# EasyEDA Pro project ProPrj_多功能方向盘_2025-05-18.epro, board PCB1
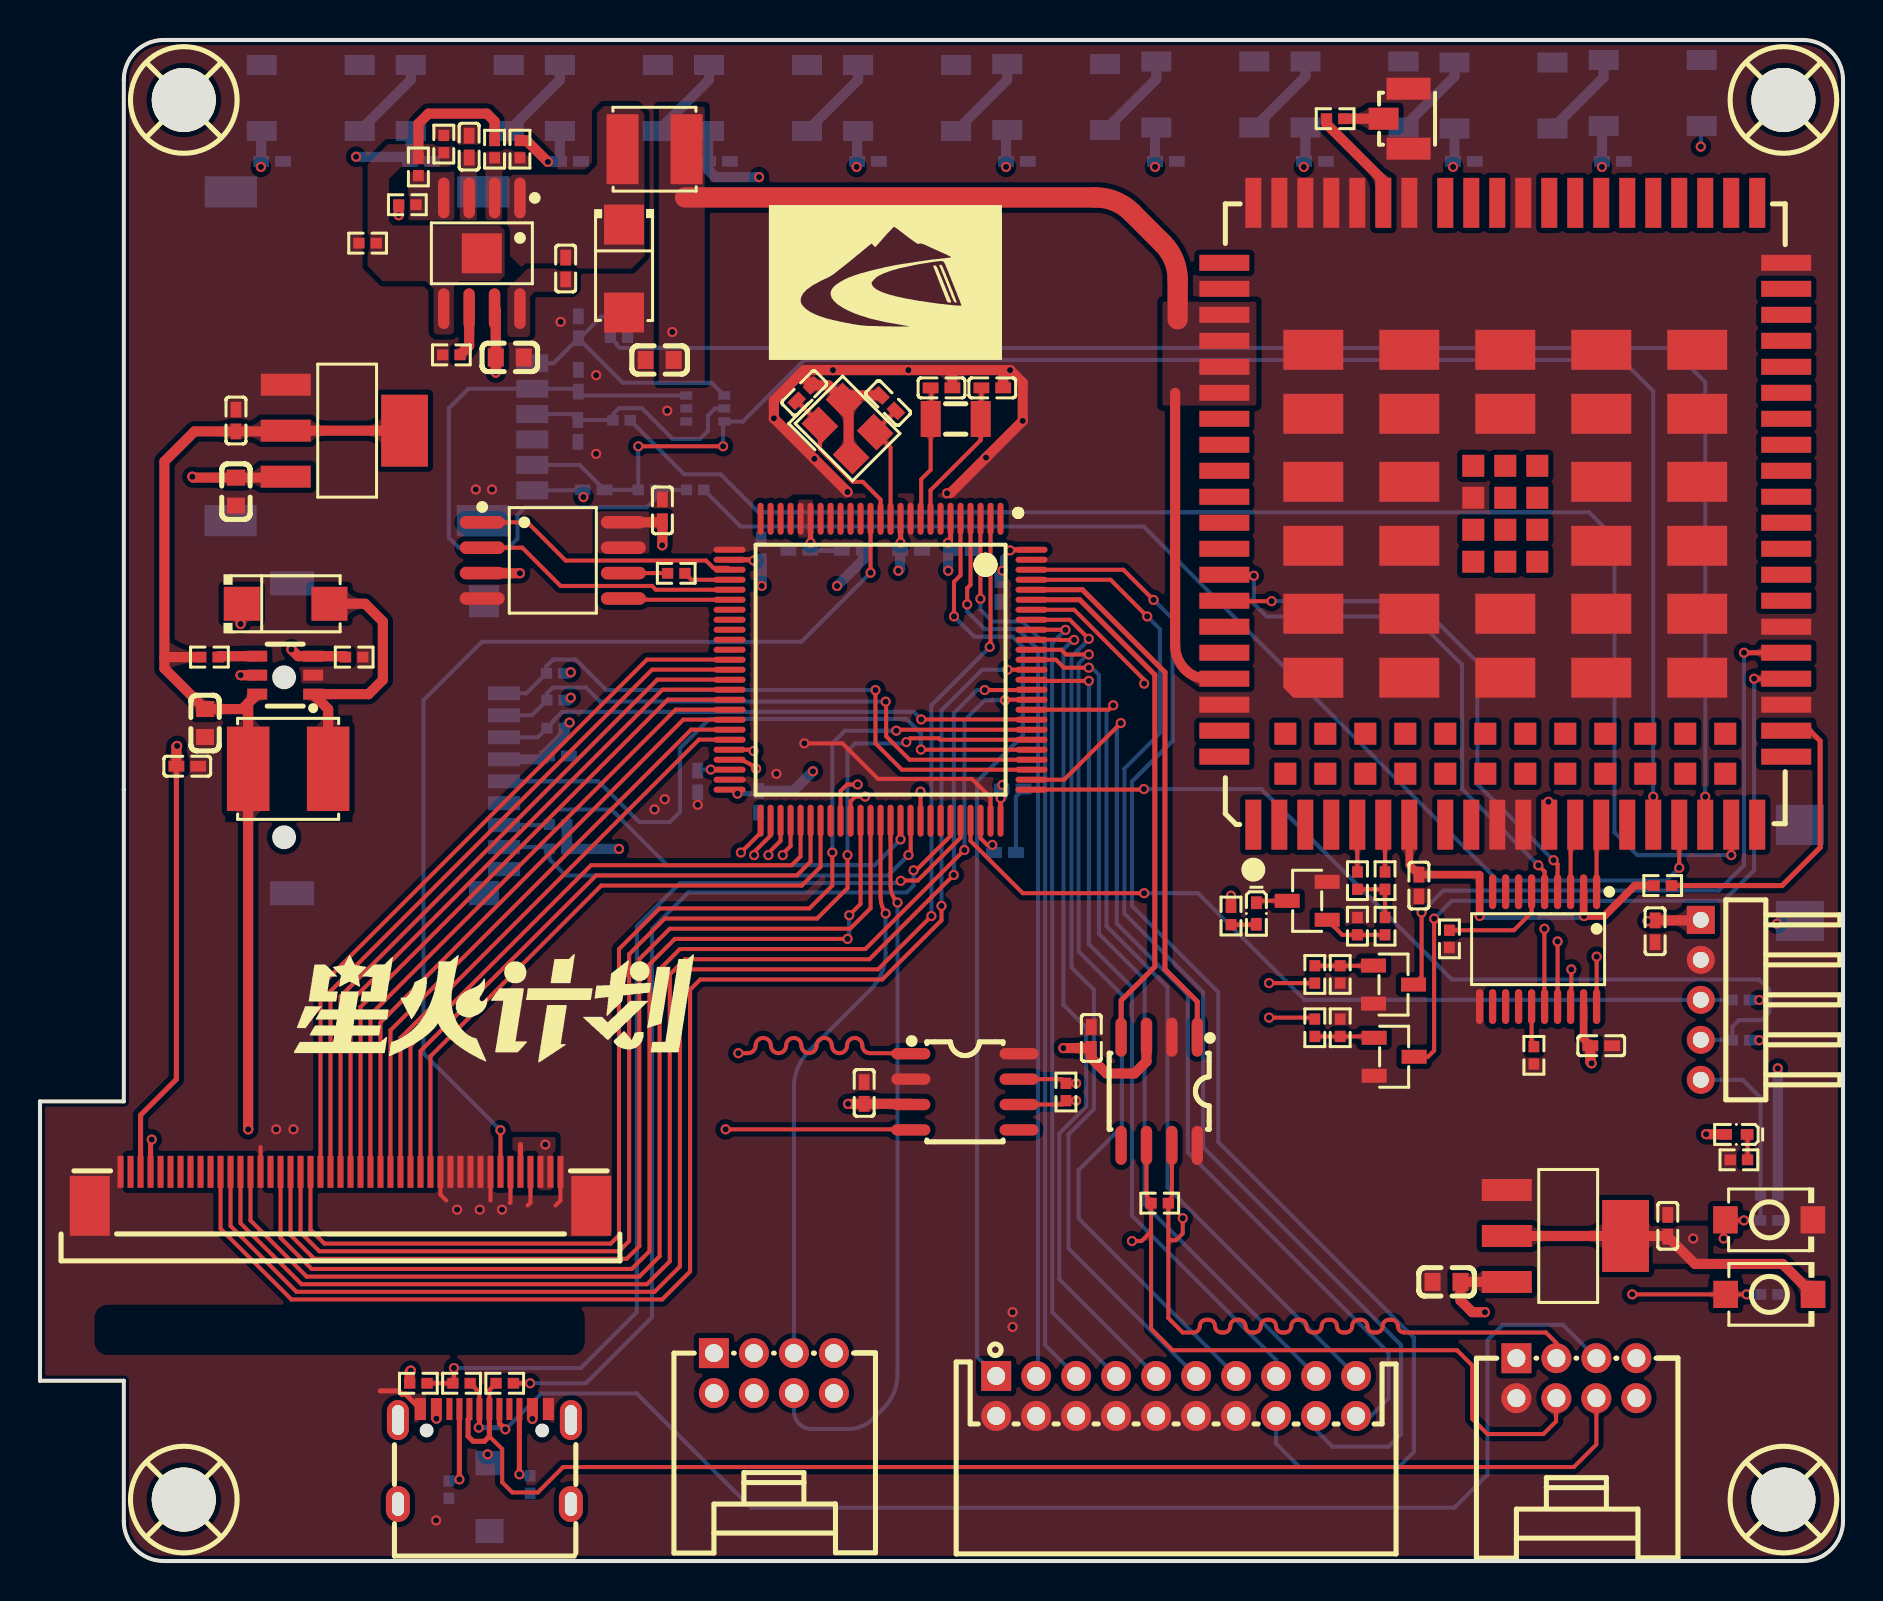
[diagram p1: board, top side]
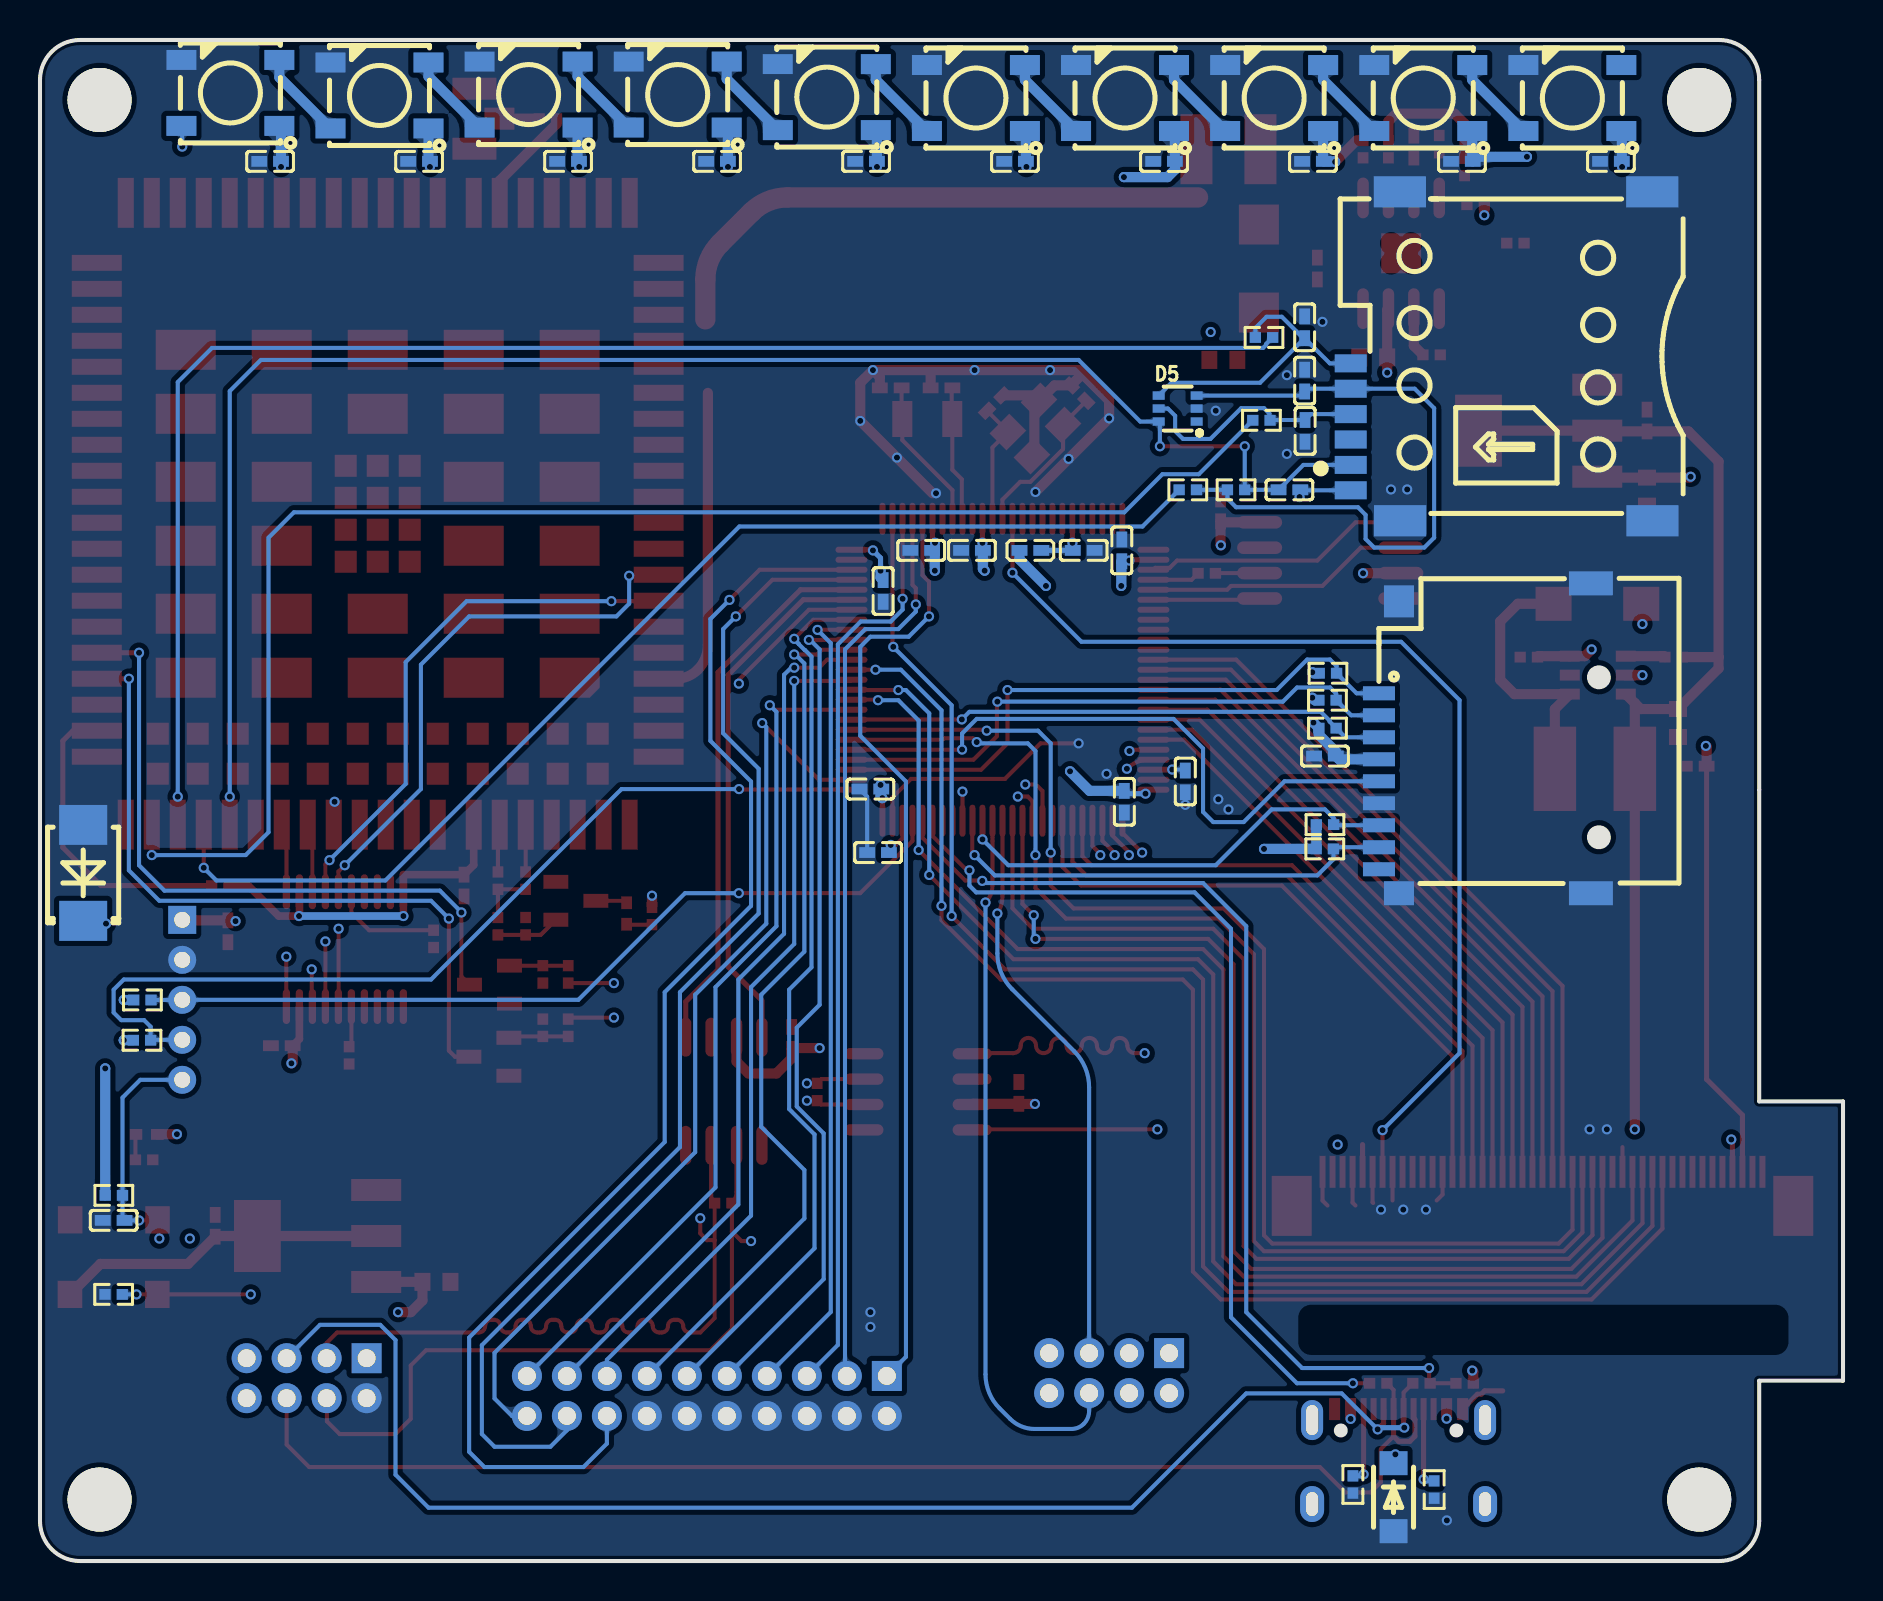
[diagram p2: board, bottom side, seen from below]

Outline 90.17 x 76.07 mm; copper layers: Top Layer, Inner1, Inner2, Bottom Layer. Coordinates in mm from the lower left corner of the outline.
Outline path: 0,22.99 0,9.02 4.19,9.02 4.19,2 arc(4.78,0.59) 6.19,0 88.17,0 arc(89.58,0.59) 90.17,2 90.17,74.07 arc(89.58,75.49) 88.17,76.07 6.19,76.07 arc(4.78,75.49) 4.19,74.07 4.19,22.99 0,22.99
Stack: Top Layer 0.035mm 外层铜厚1oz / Dielectric1 0.2104mm 7628 RC49% 8.6mil / Inner1 0.0152mm 内层铜厚 / Dielectric2 1.065mm 1.1mm H/HOZ Copper / Inner2 0.0152mm 内层铜厚 / Dielectric3 0.2104mm 7628 RC49% 8.6mil / Bottom Layer 0.035mm 外层铜厚1oz

## Design rules (mm)
template: 自定义配置
spacing copperThickness1oz (default): track to track 0.152, other pairs 0.152 to 0.3
spacing copperThickness2oz: track to track 0.203, other pairs 0.152 to 0.3
track width copperThickness1oz (default): min 0.127, default 0.254, max 2.54
track width copperThickness2oz: min 0.203, default 0.254, max 2.54
differential pair differentialPair (default): width min 0.127, default 0.254, max 2.54; gap min 0.152, default 0.152
via viaSize (default): diameter min 0.5, default 0.61, max 10; hole min 0.3, default 0.305, max 6.3
pour e581 uses copperRegion1
pour e645 uses copperRegion1
pour e661 uses copperRegion1
pour e714 uses copperRegion1
pour e723 uses copperRegion1
pour e736 uses copperRegion1
pour e789 uses copperRegion1
pour e815 uses copperRegion1
pour e1085 uses copperRegion1
pour e1437 uses copperRegion1
pour e1636 uses copperRegion1
pour e1892 uses copperRegion1
pour e3133 uses copperRegion1
pour e3984 uses copperRegion1
pour e4496 uses copperRegion1
pour e4618 uses copperRegion1
pour e5015 uses copperRegion1

## Placement (name value [footprint] x y rotation side)
C1  100nF  [C0402]  31.13 52.55 270 top
C2  100nF  [C0402]  68.96 33.78 90 top
C3  100nF  [C0402]  78.08 25.77 0 top
C4  100nF  [C0402]  52.58 26.16 270 top
C5  100nF  [C0402]  41.22 23.41 270 top
C6  100nF  [C0402]  80.77 31.5 90 top
C7  100nF  [C0402]  26.29 64.64 270 top
C8  22uF  [C0603]  30.99 60.07 180 top
C9  10uF  [C0603]  23.5 60.2 0 top
C10  2.2uF  [C0402]  32.89 38.99 90 bottom
C11  2.2uF  [C0402]  48.26 35.43 180 bottom
C12  12pF  [C0402]  45.09 58.67 180 top
C13  12pF  [C0402]  47.62 58.67 180 top
C14  220pF  [C0402]  21.46 70.74 270 top
C15  100nF  [C0402]  43.56 50.55 180 bottom
C16  100nF  [C0402]  46.1 50.55 180 bottom
C17  100nF  [C0402]  48.01 48.51 90 bottom
C18  100nF  [C0402]  48.64 38.61 180 bottom
C19  100nF  [C0402]  35.94 37.97 90 bottom
C20  100nF  [C0402]  36.07 50.55 270 bottom
C21  9pF  [C0402]  38.23 58.41 225 top
C22  9pF  [C0402]  42.42 57.91 315 top
C23  10uF  [C0603]  70.34 13.96 0 top
C24  100nF  [C0402]  81.41 16.76 90 top
C25  100nF  [C0402]  37.97 50.55 0 bottom
C26  10uF  [C0603]  8.25 41.91 270 top
C27  1uF  [C0402]  7.37 39.75 0 top
C28  10uF  [C0603]  9.8 53.49 90 top
C29  100nF  [C0402]  9.8 57.04 90 top
C30  100nF  [C0402]  86.49 17.04 0 bottom
C31  100nF  [C0402]  25.91 40.26 0 bottom
C32  100nF  [C0402]  27.69 53.58 0 bottom
C33  30pF  [C0402]  26.92 61.7 270 bottom
C34  30pF  [C0402]  26.92 59.04 270 bottom
C35  30pF  [C0402]  26.9 56.52 90 bottom
C36  100nF  [C0402]  19.06 70 0 bottom
C37  100nF  [C0402]  11.61 70 0 bottom
C38  100nF  [C0402]  41.41 70 0 bottom
C41  100nF  [C0402]  33.96 70 180 bottom
C42  100nF  [C0402]  63.76 70 180 bottom
C43  100nF  [C0402]  26.51 70 180 bottom
C44  100nF  [C0402]  48.86 70 0 bottom
C45  100nF  [C0402]  56.31 70 180 bottom
C46  100nF  [C0402]  71.21 70 0 bottom
C47  100nF  [C0402]  78.66 70 180 bottom
CAN1  TJA1050T/CM,118  [SOIC-8_L5.0-W4.0-P1.27-LS6.0-BL]  55.97 23.49 180 top
CAN2  TJA1050T/CM,118  [SOIC-8_L5.0-W4.0-P1.27-LS6.0-BL]  46.26 23.47 270 top
CARD1  TF PUSH  [TF-SMD_TF-PUSH]  17.91 41.15 90 bottom
CN1  HC-PHD-2*10AW  [CONN-TH_20P-P2.00_HCTL_HC-PHD]  56.82 8.25 0 top
CN2  HC-PHB-2*4AW  [CONN-TH_8P-P2.00_HCTL_HC-PHB-2X4AW]  76.84 9.14 0 top
CN3  HC-PHB-2*4AW  [CONN-TH_8P-P2.00_HCTL_HC-PHB-2X4AW]  36.7 9.4 0 top
D1  B340A  [SMA_L4.3-W2.6-LS5.1-RD]  29.21 64.64 270 top
D2  SMBJ3.3A  [SMB_L4.4-W3.6-LS5.3-R-RD]  88.01 34.42 90 bottom
D3  SMF5.0A  [SOD-123FL_L2.8-W1.9-LS3.7-RD]  22.48 3.19 270 bottom
D4  1N5819  [SMA_L4.4-W2.6-LS5.0-RD]  12.28 47.88 0 top
D5  SMF05C.TCT  [SC-70-6_L2.2-W1.3-P0.65-LS2.1-BR]  33.27 57.64 180 bottom
DISPLAY1  AFC07-S45FCC-00  [FPC-SMD_45P-P0.50_SLIDE-LOCK-BOTTOM-CONTACT]  15.03 18.61 0 top
FLASH1  W25Q128JVSIQ  [SOIC-8_L5.3-W5.3-P1.27-LS8.0-BL]  25.65 50.05 270 top
H1  五线下载电路  [HDR-TH_5P-P2.00-H-M_2005WR-5P]  83.06 28.07 270 top
JP1  U.FL-R-SMT-1(10)  [ANT-SMD_UFL-R-SMT-1-10]  67.82 72.14 0 top
L1  10uH  [IND-SMD_L4.0-W4.0]  30.73 70.61 180 top
L2  BLM15PD121SN1D  [L0402]  40.64 50.55 180 bottom
L3  22uH  [IND-SMD_L5.0-W5.0_H4.0]  12.41 39.62 0 top
LED1  NCD0402R1  [LED0402-RD]  84.84 21.34 180 top
LED2  NCD0402R1  [LED0402-RD]  60.83 32.39 270 top
LED3  WS2812B-B  [LED-SMD_4P-L5.0-W5.0-TL_WS2812B-B]  80.65 73.42 0 bottom
LED4  WS2812B-B  [LED-SMD_4P-L5.0-W5.0-TL_WS2812B-B]  73.19 73.3 0 bottom
LED5  WS2812B-B  [LED-SMD_4P-L5.0-W5.0-TL_WS2812B-B]  65.73 73.34 0 bottom
LED6  WS2812B-B  [LED-SMD_4P-L5.0-W5.0-TL_WS2812B-B]  58.28 73.34 0 bottom
LED7  WS2812B-B  [LED-SMD_4P-L5.0-W5.0-TL_WS2812B-B]  50.82 73.22 0 bottom
LED8  WS2812B-B  [LED-SMD_4P-L5.0-W5.0-TL_WS2812B-B]  13.53 73.17 0 bottom
LED9  WS2812B-B  [LED-SMD_4P-L5.0-W5.0-TL_WS2812B-B]  20.99 73.17 0 bottom
LED10  WS2812B-B  [LED-SMD_4P-L5.0-W5.0-TL_WS2812B-B]  28.45 73.17 0 bottom
LED11  WS2812B-B  [LED-SMD_4P-L5.0-W5.0-TL_WS2812B-B]  35.91 73.17 0 bottom
LED12  WS2812B-B  [LED-SMD_4P-L5.0-W5.0-TL_WS2812B-B]  43.36 73.17 0 bottom
Q1  S8050  [SOT-23-3_L2.9-W1.3-P1.90-LS2.4-BR]  67.72 25.22 180 top
Q2  S8050  [SOT-23-3_L2.9-W1.3-P1.90-LS2.4-BR]  67.69 28.83 180 top
Q3  S8050  [SOT-23-3_L2.9-W1.3-P1.90-LS2.4-BR]  63.37 33.02 0 top
R1  0Ω  [R0402]  65.89 34.03 90 top
R2  0Ω  [R0402]  67.27 34.03 90 top
R3  22Ω  [R0402]  31.82 49.4 0 top
R4  51kΩ  [R0402]  70.49 31.12 90 top
R5  51kΩ  [R0402]  74.71 25.29 270 top
R6  120Ω  [R0402]  56 17.9 0 top
R7  5.6kΩ  [R0402]  63.75 26.67 270 top
R8  5.6kΩ  [R0402]  63.75 29.34 90 top
R9  51kΩ  [R0402]  65.02 26.67 90 top
R10  51kΩ  [R0402]  65.02 29.34 270 top
R11  1kΩ  [R0402]  81.15 33.78 180 top
R12  0Ω  [R0402]  64.77 72.14 0 top
R13  120Ω  [R0402]  51.31 23.46 90 top
R14  24.9kΩ  [R0402]  22.73 70.61 270 top
R15  100kΩ  [R0402]  24 70.61 270 top
R16  10kΩ  [R0402]  85.05 28.06 0 bottom
R17  10kΩ  [R0402]  85.07 26.05 0 bottom
R18  4.7kΩ  [R0402]  84.96 20.07 180 top
R19  124kΩ  [R0402]  18.37 67.83 0 top
R20  200kΩ  [R0402]  20.57 60.33 180 top
R21  40.2kΩ  [R0402]  18.92 69.72 270 top
R22  0Ω  [R0402]  16.38 65.91 180 top
R23  68.1kΩ  [R0402]  20.19 70.87 90 top
R24  5.1kΩ  [R0402]  20.45 3.57 270 bottom
R25  1kΩ  [R0402]  59.56 32.26 90 top
R26  5.1kΩ  [R0402]  24.51 3.83 270 bottom
R27  10kΩ  [R0402]  86.49 13.34 180 bottom
R28  5.6kΩ  [R0402]  67.27 31.75 270 top
R29  51kΩ  [R0402]  65.89 31.75 90 top
R30  22Ω  [R0402]  23.24 8.89 180 top
R31  10kΩ  [R0402]  86.48 18.29 180 bottom
R32  22Ω  [R0402]  21.08 8.89 0 top
R33  1.5kΩ  [R0402]  18.92 8.89 0 top
R34  10kΩ  [R0402]  8.47 45.21 0 top
R35  7.5Ω  [R0402]  15.71 45.21 180 top
R36  10kΩ  [R0402]  25.91 36.83 180 bottom
R37  10kΩ  [R0402]  25.92 35.62 180 bottom
R38  10kΩ  [R0402]  25.76 44.4 180 bottom
R39  10kΩ  [R0402]  25.78 43.05 180 bottom
R40  10kΩ  [R0402]  25.78 41.66 180 bottom
R41  10kΩ  [R0402]  30.35 53.58 180 bottom
R42  22Ω  [R0402]  29.09 57.05 0 bottom
R43  22Ω  [R0402]  32.77 53.58 0 bottom
R44  22Ω  [R0402]  28.96 61.2 180 bottom
SCREW1  -  [M3螺丝]  7.19 73.07 0 top
SCREW2  -  [M3螺丝]  87.19 73.07 0 top
SCREW3  -  [M3螺丝]  7.19 3.07 0 top
SCREW4  -  [M3螺丝]  87.19 3.07 0 top
SIM1  SMC-202-6  [SIM-SMD_SMC-202-6]  17.08 60.25 90 bottom
SW1  TS-1088R-02026  [SW-SMD_L3.9-W3.0-P4.45]  86.49 13.34 0 top
SW2  TS-1088R-02026  [SW-SMD_L3.9-W3.0-P4.45]  86.48 17.06 0 top
U1  STM32H743VIT6  [LQFP-100_L14.0-W14.0-P0.50-LS16.0-BL]  42.04 44.58 180 top
U2  EC200UCNLA-N05-SGNSA  [LCC-LGA-144_L31.0-W28.0-P1.30_L610-CN-02]  73.28 52.38 90 top
U3  TXS0108EPWR  [TSSOP-20_L6.5-W4.4-P0.65-LS6.4-BL]  74.92 30.6 180 top
U4  MP1584EN-LF-Z  [SOIC-8_L5.0-W4.0-P1.27-LS6.0-BL-EP2.0]  22.1 65.41 180 top
U5  WD1117-3.3(1.35A)  [SOT-223-3_L6.5-W3.4-P2.30-LS7.0-BR]  76.33 16.26 180 top
U7  RT9293BGJ6  [SOT-23-6_L2.9-W1.6-P0.95-LS2.8-BR]  12.26 44.31 0 top
U8  WD1117-3.3(1.35A)  [SOT-223-3_L6.5-W3.4-P2.30-LS7.0-BR]  15.26 56.53 180 top
USB1  TYPE-C 16PIN  [USB-C-SMD_TYPE-C-6PIN-2MD-073]  22.22 5.22 0 top
X1  32.768kHz  [FC-135R_L3.2-W1.5]  45.79 57.12 0 top
X2  25MHz  [CRYSTAL-SMD_4P-L3.2-W2.5-BL]  40.39 56.64 315 top

## Footprints (pads in the part's own frame, mm; a bottom-side part is the same pattern mirrored in y, then rotated)
ANT-SMD_UFL-R-SMT-1-10
  rect 2.2x1.1 smd: 1(0.625,1.5) 3(0.625,-1.5)
  rect 1.5x1.1 smd: 2(-0.625,0.001)
C0402
  rect 0.79x0.54 smd: 1(-0.545,0) 2(0.545,0)
C0603
  rect 0.8x0.9 smd: 1(-0.7,0) 2(0.7,0)
CONN-TH_8P-P2.00_HCTL_HC-PHB-2X4AW
  rect 1.5x1.5 hole 0.9: 1(-3,1)
  round 1.5 hole 0.9: 2(-3,-1) 3(-1,1) 4(-1,-1) 5(1,1) 6(1,-1) 7(3,1) 8(3,-1)
CONN-TH_20P-P2.00_HCTL_HC-PHD
  rect 1.5x1.5 hole 0.9: 1(-9,1)
  round 1.5 hole 0.9: 2(-9,-1) 3(-7,1) 4(-7,-1) 5(-5,1) 6(-5,-1) 7(-3,1) 8(-3,-1) 9(-1,1) 10(-1,-1) 11(1,1) 12(1,-1) 13(3,1) 14(3,-1) 15(5,1) 16(5,-1) 17(7,1) 18(7,-1) 19(9,1) 20(9,-1)
CRYSTAL-SMD_4P-L3.2-W2.5-BL
  rect 1.4x1.2 smd: 1(-1.1,-0.85) 2(1.1,-0.85) 3(1.1,0.85) 4(-1.1,0.85)
FC-135R_L3.2-W1.5
  rect 1x1.8 smd: 1(-1.25,0) 2(1.25,0)
FPC-SMD_45P-P0.50_SLIDE-LOCK-BOTTOM-CONTACT
  rect 0.299x1.6 smd: 1(11.001,0.851) 2(10.501,0.851) 3(10,0.851) 4(9.499,0.851) 5(8.999,0.851) 6(8.499,0.851) 7(8.001,0.851) 8(7.5,0.851) 9(7,0.851) 10(6.5,0.851) 11(6,0.851) 12(5.499,0.851) 13(4.998,0.851) 14(4.501,0.851) 15(4,0.851) 16(3.5,0.851) 17(2.999,0.851) 18(2.499,0.851) 19(1.999,0.851) 20(1.498,0.851) 21(1.001,0.851) 22(0.5,0.851) 23(0,0.851) 24(-0.5,0.851) 25(-1.001,0.851) 26(-1.501,0.851) 27(-1.999,0.851) 28(-2.499,0.851) 29(-2.999,0.851) 30(-3.5,0.851) 31(-4,0.851) 32(-4.501,0.851) 33(-5.002,0.851) 34(-5.499,0.851) 35(-6,0.851) 36(-6.5,0.851) 37(-7,0.851) 38(-7.5,0.851) 39(-8.001,0.851) 40(-8.502,0.851) 41(-8.999,0.851) 42(-9.499,0.851) 43(-10,0.851) 44(-10.501,0.851) 45(-11.001,0.851)
  rect 1.999x2.999 smd: 46(-12.54,-0.851) 47(12.54,-0.851)
HDR-TH_5P-P2.00-H-M_2005WR-5P
  rect 1.4x1.4 hole 0.8: 1(-4,0)
  round 1.4 hole 0.8: 2(-2,0) 3(0,0) 4(2,0) 5(4,0)
IND-SMD_L4.0-W4.0
  rect 1.6x3.5 smd: 1(-1.6,0) 2(1.6,0)
IND-SMD_L5.0-W5.0_H4.0
  rect 2.124x4.22 smd: 1(2,0) 2(-2,0)
L0402
  rect 0.79x0.54 smd: 1(-0.545,0) 2(0.545,0)
LCC-LGA-144_L31.0-W28.0-P1.30_L610-CN-02
  rect 2.5x0.8 smd: 1(-15.55,12.6) 2(-15.55,11.3) 3(-15.55,10) 4(-15.55,8.7) 5(-15.55,7.4) 6(-15.55,6.1) 7(-15.55,4.8) 8(-15.55,0.4) 9(-15.55,-0.9) 10(-15.55,-2.2) 11(-15.55,-3.5) 12(-15.55,-4.8) 13(-15.55,-6.1) 14(-15.55,-7.4) 15(-15.55,-8.7) 16(-15.55,-10) 17(-15.55,-11.3) 18(-15.55,-12.6) 37(15.55,-12.6) 38(15.55,-11.3) 39(15.55,-10) 40(15.55,-8.7) 41(15.55,-7.4) 42(15.55,-6.1) 43(15.55,-4.8) 44(15.55,-3.5) 45(15.55,-2.2) 46(15.55,-0.9) 47(15.55,0.4) 48(15.55,4.8) 49(15.55,6.1) 50(15.55,7.4) 51(15.55,8.7) 52(15.55,10) 53(15.55,11.3) 54(15.55,12.6) 141(-15.55,3) 142(-15.55,1.7) 143(15.55,1.7) 144(15.55,3)
  rect 0.8x2.5 smd: 19(-9.55,-14.05) 20(-8.25,-14.05) 21(-6.95,-14.05) 22(-5.65,-14.05) 23(-4.35,-14.05) 24(-3.05,-14.05) 25(-1.75,-14.05) 26(-0.45,-14.05) 27(0.85,-14.05) 28(2.15,-14.05) 29(3.45,-14.05) 30(4.75,-14.05) 31(6.05,-14.05) 32(7.35,-14.05) 33(8.65,-14.05) 34(9.95,-14.05) 35(11.25,-14.05) 36(12.55,-14.05) 55(12.55,14.05) 56(11.25,14.05) 57(9.95,14.05) 58(8.65,14.05) 59(7.35,14.05) 60(6.05,14.05) 61(4.75,14.05) 62(3.45,14.05) 63(2.15,14.05) 64(0.85,14.05) 65(-0.45,14.05) 66(-1.75,14.05) 67(-3.05,14.05) 68(-4.35,14.05) 69(-5.65,14.05) 70(-6.95,14.05) 71(-8.25,14.05) 72(-9.55,14.05) 113(-10.85,14.05) 114(-12.15,14.05) 115(-10.85,-14.05) 116(-12.15,-14.05)
  rect 1.1x1.1 smd: 73(2.4,1.6) 74(2.4,0) 75(2.4,-1.6) 76(0.8,1.6) 77(0.8,0) 78(0.8,-1.6) 79(-0.8,1.6) 80(-0.8,0) 81(-0.8,-1.6) 82(-2.4,1.6) 83(-2.4,0) 84(-2.4,-1.6) 117(-11,11) 118(-11,9) 119(-11,7) 120(-11,5) 121(-11,3) 122(-11,1) 123(-11,-1) 124(-11,-3) 125(-11,-5) 126(-11,-7) 127(-11,-9) 128(-11,-11) 129(-13,11) 130(-13,9) 131(-13,7) 132(-13,5) 133(-13,3) 134(-13,1) 135(-13,-1) 136(-13,-3) 137(-13,-5) 138(-13,-7) 139(-13,-9) 140(-13,-11)
  rect 2x3 smd: 85(8.2,9.6) 86(8.2,4.8) 87(8.2,0) 88(8.2,-4.8) 89(8.2,-9.6) 90(5,9.6) 91(5,4.8) 92(5,0) 93(5,-4.8) 94(5,-9.6) 95(1.6,9.6) 96(1.6,4.8) 97(1.6,-4.8) 98(1.6,-9.6) 99(-1.6,9.6) 100(-1.6,4.8) 101(-1.6,-4.8) 102(-1.6,-9.6) 103(-5,9.6) 104(-5,4.8) 105(-5,0) 106(-5,-4.8) 107(-5,-9.6) 109(-8.2,4.8) 110(-8.2,0) 111(-8.2,-4.8) 112(-8.2,-9.6)
  custom 2x3 smd: 108(-8.2,9.6)
LED0402-RD
  rect 0.636x0.54 smd: 1(-0.538,0) 2(0.538,0)
LED-SMD_4P-L5.0-W5.0-TL_WS2812B-B
  rect 1.5x1 smd: 1(-2.45,1.65) 2(-2.45,-1.65) 3(2.45,-1.65) 4(2.45,1.65)
LQFP-100_L14.0-W14.0-P0.50-LS16.0-BL
  oval 0.3x1.6 smd: 1(-6,-7.55) 2(-5.5,-7.55) 3(-5,-7.55) 4(-4.5,-7.55) 5(-4,-7.55) 6(-3.5,-7.55) 7(-3,-7.55) 8(-2.5,-7.55) 9(-2,-7.55) 10(-1.5,-7.55) 11(-1,-7.55) 12(-0.5,-7.55) 13(0,-7.55) 14(0.5,-7.55) 15(1,-7.55) 16(1.5,-7.55) 17(2,-7.55) 18(2.5,-7.55) 19(3,-7.55) 20(3.5,-7.55) 21(4,-7.55) 22(4.5,-7.55) 23(5,-7.55) 24(5.5,-7.55) 25(6,-7.55) 51(6,7.55) 52(5.5,7.55) 53(5,7.55) 54(4.5,7.55) 55(4,7.55) 56(3.5,7.55) 57(3,7.55) 58(2.5,7.55) 59(2,7.55) 60(1.5,7.55) 61(1,7.55) 62(0.5,7.55) 63(0,7.55) 64(-0.5,7.55) 65(-1,7.55) 66(-1.5,7.55) 67(-2,7.55) 68(-2.5,7.55) 69(-3,7.55) 70(-3.5,7.55) 71(-4,7.55) 72(-4.5,7.55) 73(-5,7.55) 74(-5.5,7.55) 75(-6,7.55)
  oval 1.6x0.3 smd: 26(7.55,-6) 27(7.55,-5.5) 28(7.55,-5) 29(7.55,-4.5) 30(7.55,-4) 31(7.55,-3.5) 32(7.55,-3) 33(7.55,-2.5) 34(7.55,-2) 35(7.55,-1.5) 36(7.55,-1) 37(7.55,-0.5) 38(7.55,0) 39(7.55,0.5) 40(7.55,1) 41(7.55,1.5) 42(7.55,2) 43(7.55,2.5) 44(7.55,3) 45(7.55,3.5) 46(7.55,4) 47(7.55,4.5) 48(7.55,5) 49(7.55,5.5) 50(7.55,6) 76(-7.55,6) 77(-7.55,5.5) 78(-7.55,5) 79(-7.55,4.5) 80(-7.55,4) 81(-7.55,3.5) 82(-7.55,3) 83(-7.55,2.5) 84(-7.55,2) 85(-7.55,1.5) 86(-7.55,1) 87(-7.55,0.5) 88(-7.55,0) 89(-7.55,-0.5) 90(-7.55,-1) 91(-7.55,-1.5) 92(-7.55,-2) 93(-7.55,-2.5) 94(-7.55,-3) 95(-7.55,-3.5) 96(-7.55,-4) 97(-7.55,-4.5) 98(-7.55,-5) 99(-7.55,-5.5) 100(-7.55,-6)
M3螺丝
  round 3.2 hole 3.2: 1(0,0)
R0402
  rect 0.566x0.54 smd: 1(-0.433,0) 2(0.433,0)
SC-70-6_L2.2-W1.3-P0.65-LS2.1-BR
  rect 0.6x0.42 smd: 1(0.95,-0.65) 2(0.95,0) 3(0.95,0.65) 4(-0.95,0.65) 5(-0.95,0) 6(-0.95,-0.65)
SIM-SMD_SMC-202-6
  rect 1.56x2.61 smd: 7(-8.225,5.075) 8(-8.225,-7.543) 9(8.225,-7.537) 10(8.225,5.087)
  rect 0.9x1.6 smd: C1(-5.431,7.543) C2(-2.892,7.543) C3(-0.351,7.543) C5(-6.702,7.543) C6(-4.162,7.543) C7(-1.621,7.543)
SMA_L4.3-W2.6-LS5.1-RD
  rect 2x2 smd: 1(-2.2,0) 2(2.2,0)
SMA_L4.4-W2.6-LS5.0-RD
  rect 1.801x1.7 smd: 1(-2.192,0) 2(2.192,0)
SMB_L4.4-W3.6-LS5.3-R-RD
  rect 2x2.4 smd: 1(2.4,0) 2(-2.4,0)
SOD-123FL_L2.8-W1.9-LS3.7-RD
  rect 1.2x1.4 smd: 1(-1.7,0) 2(1.7,0)
SOIC-8_L5.0-W4.0-P1.27-LS6.0-BL
  oval 0.569x1.95 smd: 1(-1.905,-2.705) 2(-0.635,-2.705) 3(0.635,-2.705) 4(1.905,-2.705) 5(1.905,2.705) 6(0.635,2.705) 7(-0.635,2.705) 8(-1.905,2.705)
SOIC-8_L5.0-W4.0-P1.27-LS6.0-BL-EP2.0
  oval 0.574x2.038 smd: 1(-1.905,-2.769) 2(-0.635,-2.769) 3(0.635,-2.769) 4(1.905,-2.769) 5(1.905,2.769) 6(0.635,2.769) 7(-0.635,2.769) 8(-1.905,2.769)
  rect 2x2 smd: 9(0,0)
SOIC-8_L5.3-W5.3-P1.27-LS8.0-BL
  oval 0.63x2.25 smd: 1(-1.905,-3.53) 2(-0.635,-3.53) 3(0.635,-3.53) 4(1.905,-3.53) 5(1.905,3.53) 6(0.635,3.53) 7(-0.635,3.53) 8(-1.905,3.53)
SOT-23-3_L2.9-W1.3-P1.90-LS2.4-BR
  rect 1.25x0.7 smd: 1(1,-0.95) 2(1,0.95) 3(-1,0)
SOT-23-6_L2.9-W1.6-P0.95-LS2.8-BR
  rect 1x0.55 smd: 1(1.4,-0.95) 2(1.4,0) 3(1.4,0.95) 4(-1.4,0.95) 5(-1.4,0) 6(-1.4,-0.95)
SOT-223-3_L6.5-W3.4-P2.30-LS7.0-BR
  rect 2.5x1.1 smd: 1(2.97,-2.3) 2(2.97,0) 3(2.97,2.3)
  rect 2.34x3.6 smd: 4(-2.97,0)
SW-SMD_L3.9-W3.0-P4.45
  rect 1.23x1.36 smd: 1(-2.185,0) 2(2.185,0)
TF-SMD_TF-PUSH
  rect 0.7x1.6 smd: 1(2.25,5.3) 2(1.15,5.3) 3(0.05,5.3) 4(-1.05,5.3) 5(-2.15,5.3) 6(-3.25,5.3) 7(-4.35,5.3) 8(-5.45,5.3) CD(-6.55,5.3)
  rect 1.2x1.5 smd: 10(-7.75,4.3)
  rect 1.2x2.2 smd: 11(-7.75,-5.3) 12(7.75,-5.3)
  rect 1.6x1.5 smd: 13(6.85,4.3)
TSSOP-20_L6.5-W4.4-P0.65-LS6.4-BL
  oval 0.364x1.742 smd: 1(-2.925,-2.871) 2(-2.275,-2.871) 3(-1.625,-2.871) 4(-0.975,-2.871) 5(-0.325,-2.871) 6(0.325,-2.871) 7(0.975,-2.871) 8(1.625,-2.871) 9(2.275,-2.871) 10(2.925,-2.871) 11(2.925,2.871) 12(2.275,2.871) 13(1.625,2.871) 14(0.975,2.871) 15(0.325,2.871) 16(-0.325,2.871) 17(-0.975,2.871) 18(-1.625,2.871) 19(-2.275,2.871) 20(-2.925,2.871)
USB-C-SMD_TYPE-C-6PIN-2MD-073
  rect 0.55x1.1 smd: 1(-3.2,2.375) 2(-2.4,2.375) 11(2.4,2.375) 12(3.2,2.375)
  rect 0.3x1.1 smd: 3(-1.75,2.375) 4(-1.25,2.375) 5(-0.75,2.375) 6(-0.25,2.375) 7(0.25,2.375) 8(0.75,2.375) 9(1.25,2.375) 10(1.75,2.375)
  oval 1.1x2 hole 0.6x1.5: 13(-4.325,1.825) 14(4.325,1.825)
  oval 1.2x1.8 hole 0.6x1.2: 13(-4.325,-2.375) 14(4.325,-2.375)

## Nets
As in the schematic.

Pads without a net: CAN1 5; CAN2 5; CARD1 CD; D5 1; DISPLAY1 30 36 37 38 39 40 41 44; LED8 2; SCREW1 1; SCREW2 1; SCREW3 1; SCREW4 1; SIM1 C6; U2 1 2 3 4 13 18 23 24 25 26 27 28 29 30 31 32 33 34 35 37 38 39 40 41 42 43 44 45 47 55 61 62 63 64 65 66 69 70 73 74 75 77 78 79 80 81 82 83 84 113 114 116 117 118 119 120 121 122 123 124 125 126 127 128 129 130 131 132 133 134 135 136 137 138 139 140 141 142 143 144; U3 7 8 9 12 13 14; USB1 3 9 13 14

## Via types
v1: diameter 0.508, hole 0.305, Top Layer to Bottom Layer, 179 vias

## Routing (per net, layer and track width the routed paths; a pad name or vN(x,y) marks a point on that pad's centre or on a via; arc(x,y) is an arc through that point)
3V3: length 309.2
  Top Layer w0.203: U1.50 34.68,38.58 v1(34.88,38.38)
  Top Layer w0.254: U1.27 35.65,50.08 v1(35.69,50.04) ; v1(48.51,50.55) 48.55,50.58 U1.100 ; U1.75 48.04,38.15 v1(48.04,38.16) ; U1.11 v1(43.04,50.93) ; U1.6 45.54,51.05 v1(45.41,50.93)
  Top Layer w0.381: C3.1 77.2,26.11 77.2,27.73
  Top Layer w0.508: 18.49,8.89 18.49,9.47 v1(18.54,9.53) ; v1(24,49.4) 22.12,49.4 22.12,49.41 ; H1.1 83.03,32.04 C6.2 80.74,32 v1(80.39,32) ; FLASH1.8 31.07,51.95 C1.2 31.13,50.81 v1(31.12,50.8) ; SW1.2 87.15,14.86 82.77,14.86 C24.1 81.37,16.26 U5.4 U5.2 ; v1(59.56,33.27) R25.2 ; v1(83.32,21.35) 84.29,21.35 LED1.2 ; C3.1 77.53,24.96 v1(77.6,24.89)
  Inner2 w0.254: 58.8,39.24 48.56,39.24 v1(48.13,38.82)
  Inner2 w0.508: 85.98,24.68 86.02,24.64 v1(86.91,24.64) ; 85.98,24.68 v1(85.98,26.05) v1(85.98,28.06) 85.98,31.88 ; 85.98,24.68 85.98,24 v1(83.32,21.35) 82.68,20.7 ; 58.8,39.24 59.56,38.48 v1(59.56,33.27) ; v1(77.6,24.89) 78.49,24.89 82.68,20.7 ; 85.98,33.59 85.92,33.66 80.77,33.66 80.39,33.27 v1(80.39,32) ; 85.98,33.59 85.98,42.04 78.08,49.94 60.43,49.94 60.03,49.53 v1(48.13,49.53) v1(45.42,49.53) v1(42.93,49.53) 42.16,48.77 v1(39.86,48.77) 37.85,48.77 ; 85.98,33.59 85.98,31.88 ; v1(48.13,38.82) 44.64,38.82 43.95,39.5 v1(38.66,39.5) 37.97,39.5 36.96,40.51 36.96,47.88 37.85,48.77 ; 82.68,20.7 v1(82.68,16.13) ; 85.98,31.88 v1(86.87,31.88) ; 37.85,48.77 v1(36.1,48.77) 33.15,48.77 v1(31.12,50.8) 25.4,50.8 v1(24,49.4) 24,46.99 v1(26.54,44.45) v1(26.54,43.18) 26.48,43.12 v1(26.48,41.93) 28.96,39.46 v1(28.96,35.62) 28.96,33.53 33.66,28.83 52.96,28.83 55.12,26.67 55.12,22.1 45.85,12.83 30.13,12.83 25.31,8 20.95,8 19.43,9.53 v1(18.54,9.53)
  Bottom Layer w0.254: C16.2 45.41,50.69 v1(45.41,50.93) ; v1(34.88,38.38) 35.8,38.38 35.94,38.52 ; v1(48.51,50.55) 48.13,50.17 v1(48.13,49.53) ; v1(43.04,50.93) 43.04,50.57 43.02,50.55 ; 36.03,50.04 v1(35.69,50.04)
  Bottom Layer w0.508: v1(48.04,38.16) 48.13,38.24 v1(48.13,38.82) ; 35.94,38.52 37.68,38.52 v1(38.66,39.5) ; v1(86.87,31.88) 87.87,31.88 D2.2 ; v1(39.86,48.77) 41.19,50.09 L2.1 ; v1(85.98,28.06) R16.2 ; 43.02,50.55 43.02,49.62 v1(42.93,49.53) ; v1(48.13,49.53) 48.13,49.19 48.01,49.06 ; CARD1.4 25.2,40.1 C31.1 25.36,40.48 26.21,41.33 R40.1 26.21,41.66 v1(26.48,41.93) ; C16.2 45.42,50.41 v1(45.42,49.53) ; v1(26.54,44.45) 26.49,44.4 R38.1 ; v1(28.96,35.62) R37.1 26.34,35.62 R36.1 ; v1(26.54,43.18) 26.42,43.05 R39.1 ; v1(85.98,26.05) 85.98,26.05 R17.2 ; C20.2 36.1,49.97 v1(36.1,48.77) ; R31.1 v1(86.91,24.64)
5V: length 6.3
  Inner2 w0.381: v1(24.62,7.11) 23.87,6.35 23.87,6.34 23.52,5.99 23.51,5.99 22.85,5.33 v1(22.39,5.33) 21.61,5.33 v1(19.83,7.12)
+5V: length 309.2
  Top Layer w0.508: v1(72.26,12.45) 71.63,12.45 71.04,13.03 C23.2 73.35,13.96 73.36,13.96 ; v1(7.62,54.23) 7.66,54.19 C28.2 12.24,54.19 U8.3 ; CAN2.3 43.52,22.87 C5.2 41.21,22.86 v1(40.41,22.86) ; 22.73,62.64 22.8,62.57 C9.1 v1(22.8,59.44) ; v1(51.18,25.65) 52.54,25.65 C4.2 52.58,25.15 53.34,24.38 54.74,24.38 55.34,24.98 CAN1.3 ; R15.1 24.33,71.05 v1(25.4,69.98)
  Inner2 w0.508: CN2.1 73.84,11.76 ; 73.84,11.76 74.39,12.32 87,12.32 88.14,13.46 88.14,68.2 86.61,69.72 v1(78.12,69.72) v1(70.67,69.72) v1(63.2,69.72) v1(55.76,69.72) v1(48.31,69.72) v1(40.84,69.72) 35.96,69.72 ; 73.84,11.76 73.15,12.45 v1(72.26,12.45) ; 7.62,62.23 7.62,66.29 v1(11.05,69.72) 15.81,69.72 ; 7.62,62.23 v1(7.62,54.23) 7.62,48.26 5.46,46.1 5.46,27.05 7.75,24.77 34.63,24.77 34.65,24.74 35.2,24.74 35.22,24.77 40.41,24.77 ; 7.62,62.23 10.41,59.44 v1(22.8,59.44) ; v1(25.4,69.98) 25.4,69.76 25.37,69.72 ; 40.41,24.77 v1(40.41,22.86) ; 40.41,24.77 48.51,24.77 49.4,25.65 v1(51.18,25.65) ; 15.81,69.72 v1(15.81,70.23) ; 15.81,69.72 25.37,69.72 ; 35.96,69.72 v1(35.96,69.22) ; 35.96,69.72 25.37,69.72
  Bottom Layer w0.508: LED12.1 40.86,71.47 C38.1 ; v1(15.81,70.23) 18.28,70.23 C36.1 18.54,70.03 LED9.1 ; LED10.1 26,70.04 C43.2 25.43,70 v1(25.4,69.98) ; LED6.1 55.77,71.63 C45.2 ; C46.1 70.74,70.08 LED4.1 ; C37.1 11.06,71.5 LED8.1 ; C47.2 78.12,71.69 LED3.1 ; C42.2 63.28,70.07 LED5.1 ; C41.2 33.41,71.48 LED11.1 ; LED7.1 48.31,71.51 C44.1 ; 33.4,70 33.4,69.6 33.78,69.22 v1(35.96,69.22)
GND: length 62.6
  Top Layer w0.203: DISPLAY1.1 26.03,18.03 25.78,17.78 ; DISPLAY1.13 20.03,18.33 20.32,18.03 ; U1.74 47.54,38.19 46.61,39.12 41.91,39.12 40.13,40.89 v1(38.23,40.89) ; DISPLAY1.8 22.53,18.03 ; DISPLAY1.6 23.53,17.94 23.5,17.91 ; 24.38,17.78 24.53,17.92 DISPLAY1.4 ; DISPLAY1.31 11.03,20.7
  Top Layer w0.254: USB1.1 18.28,8.34 18.09,8.34 17.92,8.51 17.02,8.51
  Top Layer w0.508: X2.4 40.49,58.3 C22.1 ; X2.4 40.44,57.79 40.44,55.39 X2.2 ; X2.4 39.43,58.8 C21.1 38.07,59.34 38.07,59.41 ; 38.07,59.41 36.7,58.04 v1(36.7,57.15) v1(38.73,55.12) v1(40.39,53.47) ; 38.07,59.41 38.23,59.56 v1(39.66,59.56) v1(43.43,59.56) v1(48.51,59.56) ; 48.17,58.67 48.17,59.22 v1(48.51,59.56) ; v1(48.51,59.56) 49.15,58.93 v1(49.15,57.02) v1(47.31,55.19) 45.53,53.4 ; C12.1 45.63,59.56
  Bottom Layer w0.203: 49.19,38.61 48.81,38.23 C11.1
  vias: v1(11.81,21.59) v1(12.67,21.59) v1(19.81,2.03) v1(20.86,17.57) v1(21.8,53.59) v1(21.99,17.57) v1(22.61,53.59) v1(23.11,17.57) v1(26.03,61.98) v1(27.81,59.31) v1(27.81,55.37) v1(30.73,37.59) v1(31.24,38.1) v1(31.37,57.53) v1(32.89,37.82) v1(36.83,39.37) v1(45.36,53.4) v1(48.64,12.45) v1(48.64,11.71)
GND1: length 6.9
  Top Layer w0.508: R14.1 22.73,72.01 22.35,72.39 19.43,72.39 18.92,71.88 R21.1
VCC: length 65.7
  Top Layer w0.508: 56.77,58.42 56.77,45.8 arc(56.9,45.14) 57.28,44.58 arc(57.78,44.24) 58.36,44.13 U2.71 ; R19.1 v1(17.94,67.31)
  Top Layer w1.016: 56.9,62.1 56.9,64.1 arc(56.7,65.07) 56.15,65.9 54.59,67.46 arc(53.77,68.01) 52.8,68.2 32.26,68.2
  Inner2 w0.508: v1(17.94,67.31) 17.94,61.82 19.56,60.2 30.35,60.2 v1(31.62,61.47)
VCC_LCD: length 68.5
  Top Layer w0.254: DISPLAY1.5 24.03,20.83
  Top Layer w0.508: 6.22,45.2 6.22,54.99 7.73,56.5 C29.1 12.25,56.5 U8.2 U8.4 ; 6.22,45.2 6.22,44.64 C26.1 10.12,42.61 10.41,42.9 ; 6.22,45.2 6.23,45.21 R34.1 ; 10.41,42.9 L3.2 10.41,21.59 v1(10.41,21.59) ; 10.41,42.9 U7.6
  Inner2 w0.508: v1(10.41,21.59) 11.18,20.83 v1(25.27,20.83)
VDD_EXT: length 18.4
  Top Layer w0.381: U3.2 77.2,32.28 v1(77.22,32.26) 78.23,32.26 79.76,33.78 R11.2 ; 68.48,36.83 68.48,34.81 C2.2 72,34.33 U3.10 v1(72,32.26)
  Bottom Layer w0.381: v1(72,32.26) v1(77.22,32.26)
VDDA: length 3.2
  Top Layer w0.254: U1.20 v1(38.54,50.93)
  Bottom Layer w0.254: L2.2 C25.2 38.54,50.57 v1(38.54,50.93)
4G_RESET: length 35.9
  Top Layer w0.203: Q1.3 69.42,25.22 69.72,25.53 v1(69.72,32.13)
  Top Layer w0.254: U2.20 v1(85.72,44.13)
  Bottom Layer w0.203: v1(85.72,44.13) 85.72,34.54 84.2,33.02 70.61,33.02 v1(69.72,32.13)
4G_RXD: length 27.1
  Top Layer w0.203: U3.4 75.9,34.85 v1(75.69,35.05) ; v1(61.59,48.01) 59.25,48.01 U2.68
  Bottom Layer w0.203: v1(61.59,48.01) 68.83,48.01 71.88,44.96 71.88,38.86 v1(75.69,35.05)
4G_TXD: length 27.6
  Top Layer w0.203: v1(74.93,34.8) 75.25,34.48 U3.5 ; U2.67 59.28,49.28 v1(60.71,49.28)
  Bottom Layer w0.203: v1(74.93,34.8) 71.12,38.61 71.12,44.83 68.71,47.24 61.34,47.24 60.71,47.88 v1(60.71,49.28)
BOOT0: length 68.5
  Top Layer w0.203: U1.94 51.72,47.58 55.22,44.07 v1(55.22,43.88) ; v1(79.63,13.34) SW1.1 v1(85.34,13.34)
  Inner1 w0.203: v1(55.22,43.88) 79.31,43.88 79.63,43.56 v1(79.63,13.34)
  Bottom Layer w0.203: R27.2 v1(85.34,13.34)
CAN_H: length 56.3
  Top Layer w0.203: 56.43,16.05 R6.2 arc(56.56,18.09) 56.61,18.32 CAN1.7 ; 56.43,16.05 56.81,16.05 57.15,16.38 v1(57.15,17.15) ; 56.43,16.05 56.43,12.15 57.15,11.43 57.69,11.43 arc(57.91,11.52) 58,11.75 arc(58.1,11.97) 58.32,12.06 58.45,12.06 arc(58.67,11.97) 58.76,11.75 arc(58.86,11.52) 59.08,11.43 59.21,11.43 arc(59.43,11.52) 59.53,11.75 arc(59.62,11.97) 59.84,12.06 59.97,12.06 arc(60.2,11.97) 60.29,11.75 arc(60.38,11.52) 60.61,11.43 60.73,11.43 arc(60.96,11.52) 61.05,11.75 arc(61.14,11.97) 61.37,12.06 61.5,12.06 arc(61.72,11.97) 61.81,11.75 arc(61.91,11.52) 62.13,11.43 62.26,11.43 arc(62.48,11.52) 62.57,11.75 arc(62.67,11.97) 62.89,12.06 63.02,12.06 arc(63.24,11.97) 63.34,11.75 arc(63.43,11.52) 63.65,11.43 63.78,11.43 arc(64.01,11.52) 64.1,11.75 arc(64.19,11.97) 64.42,12.06 64.54,12.06 arc(64.77,11.97) 64.86,11.75 arc(64.95,11.52) 65.18,11.43 65.31,11.43 arc(65.53,11.52) 65.62,11.75 arc(65.72,11.97) 65.94,12.06 66.07,12.06 arc(66.29,11.97) 66.38,11.75 arc(66.48,11.52) 66.7,11.43 66.83,11.43 arc(67.05,11.52) 67.15,11.75 arc(67.24,11.97) 67.46,12.06 67.59,12.06 arc(67.82,11.97) 67.91,11.75 arc(68,11.52) 68.23,11.43 75.31,11.43 75.84,10.91 CN2.3
  Inner1 w0.203: v1(57.15,17.15) 46.45,17.15 CN3.7
CAN_H2: length 42.2
  Top Layer w0.203: v1(51.82,23.89) R13.2 51.1,24.1 48.96,24.1
  Inner1 w0.203: CN2.7 79.84,12.11 78.23,13.72 78.23,21.21 75.55,23.89 v1(51.82,23.89)
CAN_L: length 56.5
  Top Layer w0.203: CAN1.6 55.34,18.45 arc(55.4,18.15) R6.1 55.57,16.48 ; 55.57,16.48 55.57,11.62 56.64,10.54 70.87,10.54 71.63,9.78 71.63,7.11 72.39,6.35 75.18,6.35 75.82,6.99 75.82,8.13 CN2.4 ; 55.57,16.48 55.09,16 v1(54.61,16)
  Inner1 w0.203: CN3.8 47.31,16 47.91,16 arc(48.18,15.89) 48.3,15.62 arc(48.68,15.24) 49.06,15.62 arc(49.44,16) 49.82,15.62 arc(50.2,15.24) 50.58,15.62 arc(50.96,16) 51.34,15.62 arc(51.72,15.24) 52.11,15.62 arc(52.22,15.89) 52.49,16 v1(54.61,16)
CAN_L2: length 48.5
  Top Layer w0.203: CAN2.6 51.12,22.83 R13.1 v1(51.82,23.02)
  Inner1 w0.203: CN2.8 79.84,6.56 78.99,5.72 72.39,5.72 71.25,6.86 71.25,21.21 69.43,23.02 v1(51.82,23.02)
CC1: length 4.1
  Top Layer w0.254: USB1.4 v1(20.98,4.08)
  Bottom Layer w0.254: R24.1 20.9,4.01 v1(20.98,4.08)
CC2: length 3.8
  Top Layer w0.254: USB1.10 v1(23.97,4.34)
  Bottom Layer w0.254: v1(23.97,4.34) 24.05,4.26 R26.1
DN: length 66.3
  Top Layer w0.203: CN2.6 77.84,5.83 76.71,4.7 26.16,4.7 24.89,3.43 23.62,3.43 23.11,3.94 23.11,5.6 22.47,6.24 ; USB1.7 22.47,8.56 22.81,8.89
  Top Layer w0.254: USB1.5 21.48,7.14 21.41,7.08 21.41,6.24 21.66,5.99 22.22,5.99 22.47,6.24 USB1.7
DP: length 70.9
  Top Layer w0.203: R32.2 21.98,8.43 USB1.6
  Top Layer w0.254: USB1.6 21.98,6.7 v1(21.94,6.67) ; v1(23.27,6.58) 22.97,6.88 USB1.8
  Bottom Layer w0.203: CN2.5 76.17,11.81 73.15,11.81 72.39,11.05 72.39,4.32 70.74,2.67 35.56,2.67 29.84,8.38 25.07,8.38 v1(23.27,6.58)
  Bottom Layer w0.254: v1(21.94,6.67) 23.19,6.67
FDCAN1_RX: length 26.5
  Top Layer w0.254: CAN1.4 54.07,28.03 55.75,29.72 55.75,44.32 52,48.08 U1.95
FDCAN1_TX: length 27.3
  Top Layer w0.254: CAN1.1 57.88,27.98 56.26,29.59 56.26,44.45 52.13,48.58 U1.96
FDCAN2_RX: length 25.4
  Top Layer w0.203: CAN2.4 43.53,21.59 v1(34.29,21.59) ; v1(35.05,35.43) 36.04,36.42 U1.51
  Inner1 w0.203: v1(35.05,35.43) 34.29,34.67 v1(34.29,21.59)
FDCAN2_TX: length 24.4
  Top Layer w0.203: v1(34.93,25.4) 35.41,25.4 arc(35.68,25.51) 35.79,25.78 arc(36.17,26.16) 36.55,25.78 arc(36.93,25.4) 37.31,25.78 arc(37.69,26.16) 38.08,25.78 arc(38.46,25.4) 38.84,25.78 arc(39.22,26.16) 39.6,25.78 arc(39.98,25.4) 40.36,25.78 arc(40.74,26.16) 41.12,25.78 arc(41.24,25.51) 41.5,25.4 43.53,25.4 CAN2.1 ; U1.52 36.54,36.28 35.71,35.46 v1(35.71,35.31)
  Inner1 w0.203: v1(35.71,35.31) 34.93,34.52 v1(34.93,25.4)
FMC_A19: length 76.4
  Top Layer w0.203: DISPLAY1.34 9.53,16.76 12.83,13.46 30.73,13.46 32,14.73 32,29.08 32.51,29.59 41.91,29.59 v1(44.58,32.26) ; v1(47.5,45.72) 47.54,45.76 U1.2
  Bottom Layer w0.203: v1(44.58,32.26) 44.58,42.8 v1(47.5,45.72)
FMC_D0: length 53.7
  Top Layer w0.203: v1(40.47,32.3) 41.04,32.87 U1.61 ; DISPLAY1.29 12.03,16.16 13.59,14.61 29.59,14.61 30.48,15.49 30.48,29.85 31.75,31.12 v1(40.39,31.12)
  Bottom Layer w0.203: v1(40.39,31.12) 40.47,31.2 v1(40.47,32.3)
FMC_D1: length 52.7
  Top Layer w0.203: DISPLAY1.28 12.53,16.3 13.72,15.11 29.34,15.11 29.97,15.75 29.97,30.1 31.5,31.62 40.51,31.62 41.54,32.65 U1.62
FMC_D2: length 63.1
  Top Layer w0.203: U1.81 45.03,41.08 44.96,41.15 43.51,41.15 v1(43.32,40.96) ; DISPLAY1.27 13.03,16.43 13.97,15.49 28.96,15.49 29.46,16 29.46,30.35 31.24,32.13 38.86,32.13 40.39,33.66 v1(40.39,35.31)
  Bottom Layer w0.203: v1(40.39,35.31) 40.39,40.51 40.77,40.89 43.26,40.89 v1(43.32,40.96)
FMC_D3: length 62.4
  Top Layer w0.203: U1.82 42.87,41.58 v1(42.82,41.53) ; v1(39.62,35.43) 39.62,33.78 38.48,32.64 30.99,32.64 28.96,30.61 28.96,16.29 28.54,15.88 14.22,15.88 13.53,16.57 DISPLAY1.26
  Bottom Layer w0.203: v1(42.82,41.53) 40.26,41.53 39.62,40.89 v1(39.62,35.43)
FMC_D4: length 36.5
  Top Layer w0.203: DISPLAY1.25 14.03,28.76 30.35,45.08 34.44,45.08
FMC_D5: length 35.6
  Top Layer w0.203: 34.44,44.58 30.61,44.58 14.53,28.5 DISPLAY1.24
FMC_D6: length 34.7
  Top Layer w0.203: DISPLAY1.23 15.03,28.24 30.87,44.08 34.44,44.08
FMC_D7: length 33.9
  Top Layer w0.203: DISPLAY1.22 15.53,27.98 31.14,43.58 34.44,43.58
FMC_D8: length 33
  Top Layer w0.203: DISPLAY1.21 16.03,27.71 31.4,43.08 34.44,43.08
FMC_D9: length 32.1
  Top Layer w0.203: 34.44,42.58 31.79,42.58 16.53,27.32 DISPLAY1.20
FMC_D10: length 31.2
  Top Layer w0.203: 34.44,42.08 32.18,42.08 17.03,26.93 DISPLAY1.19
FMC_D11: length 30.2
  Top Layer w0.203: DISPLAY1.18 17.53,26.55 32.56,41.58 34.44,41.58
FMC_D12: length 29.3
  Top Layer w0.203: DISPLAY1.17 18.03,26.16 32.95,41.08 34.44,41.08
FMC_D13: length 31.5
  Top Layer w0.203: DISPLAY1.16 18.53,25.77 27.56,34.8 37.59,34.8 38.04,35.24 U1.55
FMC_D14: length 31.5
  Top Layer w0.203: DISPLAY1.15 19.03,25.51 27.81,34.29 37.85,34.29 38.54,34.98 U1.56
FMC_D15: length 31.5
  Top Layer w0.203: DISPLAY1.14 19.53,25.25 28.07,33.78 38.1,33.78 39.04,34.72 U1.57
FMC_NE1: length 72.3
  Top Layer w0.203: 49.53,44.58 49.53,44.58 v1(48.39,44.58) ; DISPLAY1.35 9.03,16.62 12.57,13.08 31.12,13.08 32.51,14.48 32.51,28.58 33.02,29.08 42.12,29.08 45.09,32.05 v1(45.09,32.77)
  Bottom Layer w0.203: v1(45.09,32.77) 45.09,42.55 47.12,44.58 v1(48.39,44.58)
FMC_NOE: length 66.8
  Top Layer w0.203: DISPLAY1.32 10.53,17.03 13.34,14.22 29.97,14.22 30.99,15.24 30.99,29.59 32,30.61 41.28,30.61 v1(46.23,35.56) ; v1(48.26,43.05) 48.29,43.08 49.53,43.08
  Bottom Layer w0.203: v1(46.23,35.56) 46.23,42.04 47.24,43.05 v1(48.26,43.05)
FMC_NWE: length 68.8
  Top Layer w0.203: DISPLAY1.33 10.03,16.9 13.08,13.84 30.35,13.84 31.5,14.99 31.5,29.34 32.26,30.1 41.49,30.1 v1(45.7,34.31) ; v1(47.24,43.56) 49.51,43.56 49.53,43.58
  Bottom Layer w0.203: v1(47.24,43.56) 46.86,43.56 45.7,42.4 v1(45.7,34.31)
INPUT1: length 43
  Top Layer w0.203: U1.84 53.45,42.58 v1(53.67,42.8)
  Bottom Layer w0.203: v1(53.67,42.8) 53.34,42.47 53.34,31.75 56.39,28.7 56.39,18.69 CN1.19
INPUT2: length 43.3
  Top Layer w0.203: v1(52.45,44.68) 51.21,44.68 50.81,45.08 U1.89
  Bottom Layer w0.203: v1(52.45,44.68) 52.6,44.68 52.96,44.32 52.96,31.37 55.25,29.08 55.25,17.83 CN1.17
INPUT3: length 41.5
  Top Layer w0.203: v1(52.45,44.02) 49.65,44.02 U1.87
  Bottom Layer w0.203: CN1.15 61.82,10.06 54.61,17.27 54.61,28.7 52.45,30.86 v1(52.45,44.02)
INPUT4: length 44.3
  Top Layer w0.203: U1.90 51.07,45.58 51.31,45.34 v1(52.45,45.34)
  Bottom Layer w0.203: CN1.13 51.94,17.13 51.94,19.56 54.1,21.72 54.1,28.32 51.94,30.48 51.94,44.89 52.39,45.34 v1(52.45,45.34)
INPUT5: length 44.1
  Top Layer w0.203: U1.93 51.5,47.08 v1(52.45,46.12)
  Bottom Layer w0.203: v1(52.45,46.12) 52.45,46.1 52.23,45.88 52.23,45.86 51.93,45.56 51.91,45.56 51.59,45.24 51.59,29.69 52.71,28.58 52.71,22.61 51.44,21.34 51.44,15.64 CN1.11
INPUT6: length 42.2
  Top Layer w0.203: U1.91 50.95,46.08 50.96,46.07 51.07,46.07 51.07,46.06 51.5,46.06 51.5,46.07 v1(51.72,46.07)
  Bottom Layer w0.203: CN1.9 50.98,14.1 50.98,21.39 52.32,22.73 52.32,26.68 51.18,27.82 51.18,45.59 51.66,46.07 v1(51.72,46.07)
INPUT7: length 40.6
  Top Layer w0.203: U1.92 51.28,46.58 v1(51.28,46.57)
  Bottom Layer w0.203: v1(51.28,46.57) 50.62,45.91 50.62,12.45 CN1.7
INPUT8: length 45.7
  Top Layer w0.203: U1.3 47.03,52.12 v1(47.03,48.13)
  Bottom Layer w0.203: CN1.5 50.27,10.81 50.27,45.85 49.12,46.99 47.62,46.99 47.03,47.59 v1(47.03,48.13)
INPUT9: length 45.4
  Top Layer w0.203: v1(46.37,47.84) 46.37,48.66 46.54,48.82 U1.4
  Bottom Layer w0.203: v1(46.37,47.84) 46.37,47.48 47.24,46.61 48.9,46.61 49.91,45.59 49.91,9.35 CN1.3
INPUT10: length 46.9
  Top Layer w0.203: v1(45.71,47.24) 45.71,48.98 46.04,49.3 U1.5
  Bottom Layer w0.203: CN1.1 46.86,10.21 46.86,38.99 49.15,41.28 49.15,45.72 48.64,46.23 46.73,46.23 v1(45.71,47.24)
LEDA: length 32.8
  Top Layer w0.254: C27.1 6.82,24.09 5.03,22.3 DISPLAY1.43
  Top Layer w0.508: v1(6.86,40.77) 6.82,40.73 C27.1 ; D4.1 10.03,47.82 v1(10.03,46.86) ; U7.5 v1(10.03,44.31)
  Inner2 w0.508: v1(6.86,40.77) 6.86,43.56 7.6,44.31 v1(10.03,44.31) v1(10.03,46.86)
LEDK: length 34.6
  Top Layer w0.254: DISPLAY1.42 5.53,21.02 v1(5.59,21.08)
  Top Layer w0.508: R35.2 15.23,45.26 U7.3 12.91,45.26 v1(12.57,45.59)
  Inner1 w0.508: v1(12.57,45.59) 8,45.59 5.59,43.18 v1(5.59,21.08)
NET: length 2.8
  Top Layer w0.203: R28.1 R2.1 R1.1
NRST: length 155.2
  Top Layer w0.203: DISPLAY1.7 23.03,21.55 ; v1(84.2,16.13) 84.2,16.97 SW2.1 84.32,17.04 v1(85.22,17.04) ; U1.14 v1(41.54,49.43)
  Inner1 w0.203: v1(23.03,21.55) 28.74,21.55 29.97,20.32 29.97,6.1 35.18,0.89 78.87,0.89 84.2,6.22 v1(84.2,16.13)
  Bottom Layer w0.203: v1(85.22,17.04) C30.1 86.04,17.14 R31.2 86.04,23.18 85.15,24.07 H1.5 ; v1(23.03,21.55) 19.18,25.4 19.18,43.05 22.1,45.97 38.08,45.97 v1(41.54,49.43)
OSC32_IN: length 7.6
  Top Layer w0.203: U1.8 44.54,53.55 47.04,56.06 X1.2 47.08,57.15 C13.2
OSC32_OUT: length 6.5
  Top Layer w0.203: U1.9 44.07,52.16 44.07,54.1 44.54,54.58 44.54,57.12 44.58,57.15 44.58,58.42
OSC_IN: length 6.1
  Top Layer w0.203: U1.12 42.54,55.69 X2.3 41.77,56.49 C22.2
OSC_OUT: length 7.9
  Top Layer w0.203: U1.13 42.04,53.09 41.15,53.98 40.64,53.98 39.01,55.61 X2.1 39.01,56.86 C21.2
PA4: length 13.4
  Top Layer w0.203: 22.12,51.95 24.38,51.95 26.29,50.04 33.31,50.04 33.67,49.67 34.39,49.67 U1.28
PA5: length 2.4
  Top Layer w0.203: U1.29 32.58,49.08 R3.2
PA6: length 13.2
  Top Layer w0.203: 22.12,50.68 24.12,50.68 26.03,48.77 30.61,48.77 30.8,48.58 U1.30
PA7: length 5.3
  Top Layer w0.203: U1.31 29.24,48.08 FLASH1.5
PA11: length 45.8
  Top Layer w0.203: v1(24.51,8.89) R30.1 ; v1(43.69,34.54) 43.81,34.54 45.54,36.27 U1.70
  Bottom Layer w0.203: v1(24.51,8.89) 27.31,8.89 30.61,12.19 30.61,31.62 32.43,33.44 43.35,33.44 43.69,33.78 v1(43.69,34.54)
PA12: length 50.6
  Top Layer w0.203: v1(43.05,34.02) 43.07,34.04 43.9,34.04 46.04,36.18 U1.71 ; R33.2 R32.1 20.7,8.94 v1(20.7,9.65)
  Bottom Layer w0.203: v1(20.7,9.65) 27.05,9.65 29.84,12.45 29.84,31.75 32,33.91 42.94,33.91 v1(43.05,34.02)
PA13: length 42.4
  Top Layer w0.203: v1(55.22,33.4) 49.15,33.4 46.54,36.01 U1.72
  Bottom Layer w0.203: v1(55.22,33.4) 57.91,33.4 63.25,28.07 H1.3 83.07,28.06 R16.1
PA14: length 46.7
  Top Layer w0.203: v1(55.21,38.61) 55.18,38.58 49.53,38.58
  Bottom Layer w0.203: v1(55.21,38.61) 61.09,38.61 70.61,29.08 85.98,29.08 86.49,28.58 86.49,27.43 86.11,27.05 84.96,27.05 84.64,26.73 R17.1 84.62,26.07 H1.4
PA15: length 47.1
  Top Layer w0.203: U1.77 51.22,39.08 v1(54.05,41.91)
  Bottom Layer w0.203: CN1.20 66.56,7.25 67.44,8.13 67.44,10.41 57.4,20.45 57.4,28.32 53.85,31.88 53.85,41.71 v1(54.05,41.91)
PD12: length 37.9
  Top Layer w0.203: U1.59 40.04,38.51 40.36,38.84 v1(40.89,38.84) ; v1(61.47,27.18) 63.68,27.18 R7.1
  Inner1 w0.203: v1(40.89,38.84) 40.49,38.84 38.99,37.34 38.99,30.61 42.42,27.18 v1(61.47,27.18)
PD13: length 32.5
  Top Layer w0.203: 63.75,28.9 v1(61.47,28.9) ; U1.60 40.54,38 40.77,38.23 v1(41.27,38.23)
  Inner1 w0.203: v1(61.47,28.9) 43.23,28.9 41.4,30.73 41.4,38.1 v1(41.27,38.23)
PE0: length 59.7
  Top Layer w0.203: v1(55.37,47.24) 53.54,49.08 U1.97
  Bottom Layer w0.203: CN1.18 63.82,6.54 64.64,5.72 67.44,5.72 68.07,6.35 68.07,10.8 58.17,20.7 58.17,28.45 54.23,32.39 54.23,39.62 56.01,41.4 56.01,46.61 v1(55.37,47.24)
PE1: length 65.5
  Top Layer w0.203: U1.98 54.18,49.58 v1(55.69,48.07)
  Bottom Layer w0.203: v1(55.69,48.07) 56.64,47.12 56.64,41.02 54.61,38.99 54.61,32.77 58.93,28.45 58.93,20.96 68.71,11.18 68.71,5.46 67.94,4.7 62.99,4.7 61.82,5.87 CN1.16
PWRKEY: length 33.6
  Top Layer w0.203: v1(69.09,32.44) 69.09,29.23 Q2.3
  Top Layer w0.254: U2.21 v1(85.22,45.43)
  Bottom Layer w0.203: v1(85.22,45.43) 85.22,34.8 83.95,33.53 70.17,33.53 69.09,32.45 v1(69.09,32.44)
RF_ANT: length 5.4
  Top Layer w0.508: 67.18,67.93 67.18,69.03 64.34,71.87 R12.1
RX_DBG: length 3.5
  Top Layer w0.203: U3.3 76.55,36.59 U2.11
SDMMC1_CK: length 32.3
  Top Layer w0.203: v1(44.06,40.58) 44.06,40.58 U1.80
  Bottom Layer w0.203: CARD1.5 27.93,39 29.97,36.96 31.5,36.96 32,37.47 32,40.64 33.48,42.12 43.33,42.12 44.06,41.39 v1(44.06,40.58)
SDMMC1_CMD: length 27.1
  Top Layer w0.203: U1.83 49.57,42.09 v1(44.07,42.09)
  Bottom Layer w0.203: CARD1.3 24.89,41.2 R40.2 25.68,41.99 25.68,42.03 26.12,42.47 43.69,42.47 v1(44.07,42.09)
SDMMC1_D0: length 23
  Top Layer w0.203: v1(43.04,36.09) U1.65
  Bottom Layer w0.203: v1(43.04,36.09) 41.74,34.8 31.37,34.8 28.57,37.59 25.91,37.59 25.47,37.16 R36.2 25.44,36.8 23.21,36.8
SDMMC1_D1: length 23.3
  Top Layer w0.203: v1(43.43,35.31) 43.54,35.42 43.54,37.02 U1.66
  Bottom Layer w0.203: CARD1.8 25.4,35.7 R37.2 25.48,35.1 26.29,34.29 42.42,34.29 v1(43.43,35.31)
SDMMC1_D2: length 31.1
  Top Layer w0.203: v1(41.78,43.56) 41.78,40.89 43.1,39.58 U1.78
  Bottom Layer w0.203: CARD1.1 24.32,43.4 R38.2 25.33,44.76 25.65,45.09 26.8,45.09 28.32,43.56 v1(41.78,43.56)
SDMMC1_D3: length 29.6
  Top Layer w0.203: U1.79 43.49,40.08 42.32,41.25 42.32,42.95 v1(42.29,42.98)
  Bottom Layer w0.203: v1(42.29,42.98) 28.01,42.98 27.31,43.69 25.65,43.69 25.35,43.38 R39.2 24.59,42.3 23.21,42.3
SIM_GND: length 59.5
  Top Layer w0.203: v1(75.44,37.97) 75.44,36.87 75.48,36.83
  Inner1 w0.203: v1(27.18,53.21) 28.57,53.21 30.48,51.31 31.33,51.31 31.62,51.01 31.62,50.17 44.2,37.59 75.06,37.59 75.44,37.97
  Bottom Layer w0.203: SIM1.C5 27.12,53.55 C32.1 arc(27.17,53.53) 27.18,53.49 v1(27.18,53.21)
TIM1_CH1: length 67.8
  Top Layer w0.203: U1.67 v1(44.04,38.48)
  Inner1 w0.203: v1(44.04,38.48) 45.18,39.62 49.28,39.62 52.96,43.31 52.96,46.86 56.26,50.17 80.9,50.17 83.06,52.32 v1(83.06,70.74)
  Bottom Layer w0.203: v1(83.06,70.74) 83.06,71.68 arc(83.07,71.73) LED3.4
TX_DBG: length 3.5
  Top Layer w0.203: U3.1 77.85,36.59 U2.12
USART1_RX: length 36
  Top Layer w0.203: U1.54 37.54,35.76 37.14,35.37 v1(37.14,35.31)
  Inner1 w0.203: v1(37.14,35.31) 37.14,35.87 arc(37.1,36.12) 36.96,36.32 arc(36.39,36.7) 35.73,36.83 34.45,36.83 arc(33.95,36.73) 33.53,36.45 32.88,35.8 arc(32.32,34.97) 32.13,34 32.13,9.76 arc(32.2,9.43) 32.38,9.14 32.73,8.8 arc(33.17,8.5) CN3.2
USART1_TX: length 30.5
  Top Layer w0.203: v1(36.43,35.31) 36.43,35.41 37.04,36.02 U1.53
  Inner1 w0.203: CN3.1 33.7,34.52 arc(33.86,35.29) 34.29,35.94 arc(34.57,36.13) 34.9,36.2 35.71,36.2 arc(36.04,36.13) 36.32,35.94 arc(36.4,35.82) 36.43,35.69 v1(36.43,35.31)
USART3_RX: length 93.8
  Top Layer w0.203: v1(75.24,31.62) 75.24,27.74 75.25,27.73 ; U1.47 34.72,40.08 arc(35.31,39.96) v1(35.81,39.62)
  Inner1 w0.203: v1(75.24,31.62) 60.07,31.62 54.48,37.21 43.94,37.21 39.75,41.4 34.8,41.4 34.42,41.02 34.42,39.9 34.69,39.62 v1(35.81,39.62) 35.81,38.84 arc(35.75,38.51) 35.56,38.23 35.5,38.17 arc(35,37.84) 34.42,37.72 arc(33.71,37.58) 33.12,37.18 32.11,36.18 arc(31.56,35.35) 31.37,34.38 31.37,7.78 arc(31.47,7.28) 31.75,6.86 arc(32.31,6.48) 32.98,6.35 34.39,6.35 arc(34.88,6.45) 35.31,6.73 arc(35.6,7.17) 35.7,7.69 CN3.4
USART3_TX: length 79.6
  Top Layer w0.203: 75.9,27.73 v1(75.9,30.99) ; U1.46 35.53,40.58 arc(35.62,40.56) v1(35.69,40.51)
  Inner1 w0.203: CN3.3 35.7,30.84 arc(35.9,31.81) 36.45,32.64 37.23,33.42 arc(37.78,34.24) 37.97,35.22 37.97,38.57 arc(37.85,39.34) 37.51,40.04 37.37,40.18 arc(37.23,40.29) 37.08,40.39 ; 37.08,40.39 37.05,40.39 37.02,40.42 arc(36.79,40.49) 36.56,40.51 v1(35.69,40.51) ; 37.08,40.39 40.06,40.39 43.75,36.7 53.34,36.7 59.06,30.99 v1(75.9,30.99)
USART6_RX: length 74.5
  Top Layer w0.203: v1(77.85,30.23) 77.85,27.73 77.85,27.73 ; U1.64 42.54,36.18 arc(42.53,36.09) 42.54,36 42.54,33.77 arc(42.63,33.32) v1(42.88,32.93)
  Inner1 w0.203: v1(77.85,30.23) 45.59,30.23 v1(42.88,32.93)
  Bottom Layer w0.203: v1(42.88,32.93) 42.88,9.33 arc(42.7,8.42) 42.18,7.64 41.66,7.11 arc(41.09,6.74) 40.43,6.6 38.59,6.6 arc(38.25,6.67) 37.97,6.86 arc(37.77,7.16) 37.7,7.51 CN3.6
USART6_TX: length 65.7
  Top Layer w0.203: 76.55,27.73 76.58,27.76 v1(76.58,29.59) ; U1.63 42.04,33.25 arc(42.1,32.8) v1(42.29,32.39)
  Inner1 w0.203: v1(76.58,29.59) 45.09,29.59 v1(42.29,32.39)
  Bottom Layer w0.203: CN3.5 37.7,23.7 arc(37.9,24.67) 38.45,25.49 41.55,28.59 arc(42.1,29.42) 42.29,30.39 v1(42.29,32.39)
USIM_CLK: length 77.8
  Top Layer w0.203: U2.16 v1(83.28,38.23)
  Bottom Layer w0.203: R44.2 28.85,60.87 28.85,60.82 29,60.67 81.57,60.67 83.28,58.96 v1(83.28,38.23)
USIM_DATA: length 59.3
  Top Layer w0.203: U2.15 v1(81.98,34.67)
  Bottom Layer w0.203: R43.2 35.03,51.74 55.19,51.74 72.9,34.04 81.34,34.04 v1(81.98,34.67)
USIM_RST: length 74.2
  Top Layer w0.203: U2.17 v1(84.58,35.31)
  Bottom Layer w0.203: v1(84.58,35.31) 79.88,35.31 78.74,36.45 78.74,51.18 77.47,52.45 35.94,52.45 34.04,54.36 32.22,54.36 R42.2
USIM_VDD: length 83.6
  Top Layer w0.203: U2.14 v1(80.68,38.23) ; v1(29.92,55.75) v1(34.16,55.75)
  Bottom Layer w0.203: v1(29.92,55.75) R41.2 C32.2 26.99,54.82 SIM1.C1 ; v1(34.16,55.75) 34.16,56.93 D5.6 35.15,56.99 38.23,60.07 79.12,60.07 80.68,58.51 v1(80.68,38.23)
VCAP1: length 0.7
  Bottom Layer w0.203: C10.2 32.94,39.58 v1(33.55,39.58)
VCAP2: length 2
  Top Layer w0.203: U1.73 47.04,36.15 47.37,35.81 v1(47.62,35.81)
  Bottom Layer w0.203: v1(47.62,35.81) 47.72,35.72 C11.2
$1N2746: length 1.3
  Top Layer w0.203: LED1.1 85.4,21.31 R18.1
$1N7333: length 14.9
  Bottom Layer w0.203: D5.4 33.59,58.93 29.15,58.93 C33.2 ; R44.1 29.39,61.67 28.83,62.23 28.07,62.23 27,61.16 C33.2 ; SIM1.C3 25.67,59.9 C33.2
$1N7334: length 33.1
  Bottom Layer w0.203: R43.1 R41.1 30.79,53.14 30.35,52.71 24.26,52.71 23.88,52.32 23.88,51.12 23.45,50.69 20.94,50.69 20.45,51.18 20.45,57.66 21.42,58.63 SIM1.C7 26.78,58.63 C34.2 27.13,58.29 D5.3
$1N7335: length 11.9
  Bottom Layer w0.203: SIM1.C2 26.61,57.36 C35.2 28.64,57.07 R42.1 28.69,57.09 28.69,57.39 28.96,57.66 30.1,57.66 31.64,56.12 33,56.12 33.4,56.52 33.4,57.28 33.76,57.64 D5.5
$1N11884: length 5.5
  Top Layer w0.203: R4.2 73.71,31.55 74.6,32.43 U3.6
$1N11885: length 2.1
  Top Layer w0.203: 74.6,27.73 74.6,25.84 R5.1
$1N12647: length 15.5
  Top Layer w0.254: 81.59,33.78 87.12,33.78 89.03,35.69 89.03,41.02 88.52,41.53 U2.115
$1N12652: length 2.4
  Top Layer w0.203: U2.5 65.88,34.47 R1.2
$1N12653: length 2.4
  Top Layer w0.203: 67.18,36.83 67.27,36.74 R2.2
$1N12864: length 2.2
  Top Layer w0.203: R3.1 31.38,49.41 FLASH1.6
$1N16034: length 2
  Top Layer w0.508: R12.2 67.19,72.14
$1N16039: length 3.2
  Top Layer w0.203: R28.2 R29.1 65.13,31.32 Q3.1
$1N16040: length 1.6
  Top Layer w0.203: LED2.1 60.93,33.02 Q3.3
$1N16049: length 3
  Top Layer w0.203: R7.2 R9.1 66.65,26.24 66.72,26.17
$1N16052: length 2.9
  Top Layer w0.203: R8.2 R10.1 66.68,29.77 Q2.1
$1N18907: length 2.5
  Top Layer w0.508: 21.46,62.64 21.46,60.78 R20.1
$1N20475: length 2
  Top Layer w0.508: U7.4 8.95,45.26 R34.2
$1N20534: length 13.8
  Top Layer w0.508: D4.2 16.26,47.88 17.14,46.99 17.14,44.07 16.43,43.36 U7.1 14.41,42.61 L3.1
$1N22074: length 1.3
  Top Layer w0.203: LED2.2 60.81,31.83 R25.1
$1N38583: length 4.4
  Bottom Layer w0.508: LED6.4 63.28,74.25 LED5.2
$1N38584: length 4.3
  Bottom Layer w0.508: LED5.4 70.74,74.25 LED4.2
$1N38585: length 4.5
  Bottom Layer w0.508: LED3.2 78.2,74.2 LED4.4
$1N38586: length 4.4
  Bottom Layer w0.508: LED11.2 33.46,74.08 LED10.4
$1N38587: length 4.4
  Bottom Layer w0.508: LED10.2 26,74.08 LED9.4
$1N38588: length 4.4
  Bottom Layer w0.508: LED9.2 18.54,74.08 LED8.4
$1N39276: length 4.5
  Bottom Layer w0.508: LED7.4 55.83,74.12 LED6.2
$1N39277: length 4.4
  Bottom Layer w0.508: LED7.2 48.37,74.08 LED12.4
$1N39279: length 4.4
  Bottom Layer w0.508: LED12.2 40.91,74.08 38.36,71.52

## Copper pours and planes (outline as drawn; the poured copper is in the pictures)
3V3 on Top Layer: 27.89,52.5 30.48,52.5 30.48,50.17 27.89,50.17
3V3 on Top Layer: 80.65,16.76 83.42,16.76 83.42,14.86 80.65,14.86
GND on Top Layer: -18.54,85.6 121.54,85.6 121.54,-11.94 -18.54,-11.94
GND on Bottom Layer: -16.64,82.3 111.12,82.3 111.12,-11.94 -16.64,-11.94
GND on Inner1: -26.67,87.12 105.16,87.12 105.16,-9.91 -26.67,-9.91
GND on Inner2: -14.61,88.14 98.93,88.14 98.93,-7.62 -14.61,-7.62
GND1 on Top Layer: 20.57,70.87 20.7,70.74 20.7,69.98 20.45,69.72 18.06,69.72 17.45,69.12 17.45,67 17.65,66.8 22.99,66.8 23.24,66.55 23.24,64.28 22.97,64.01 20.96,64.01 20.7,63.75 20.7,61.47 20.57,61.34 19.81,61.34 19.69,61.47 19.69,63.63 19.3,64.01 17.14,64.01 16.38,64.77 16.38,69.85 17.4,70.87
VCC on Top Layer: 30.95,72.73 33.24,72.73 33.24,58.93 30.95,58.93
VCC on Top Layer: 56.13,62.99 60.83,62.99 60.83,57.79 56.13,57.79
VCC_LCD on Top Layer: 23.62,21.21 25.78,21.21 25.78,18.54 23.62,18.54
VDDA on Top Layer: 37.72,53.09 38.86,53.09 38.86,51.18 37.72,51.18
EN on Top Layer: 22.52,66.93 22.27,67.17 22.27,70.4 22.48,70.61 24.28,70.61 24.5,70.39 24.5,69.89 24.28,69.67 23.31,69.67 23.11,69.47 23.11,67.17 22.87,66.93
$1N18895 on Top Layer: 23.37,61.34 23.37,63.63 24.38,64.64 26.56,64.64 26.79,64.42 26.79,63.63 26.63,63.47 24.74,63.47 24.51,63.25 24.51,61.34 24.38,61.21 23.5,61.21
$1N18896 on Top Layer: 23.37,69.09 23.62,69.34 27.36,69.34 27.86,69.84 27.86,72.44 28.19,72.77 29.84,72.77 30.23,72.39 30.23,65.27 29.6,64.64 24.13,64.64 23.37,65.41
$1N18899 on Top Layer: 20.99,70.67 21.84,70.67 21.84,67.06 20.99,67.06
$1N18902 on Top Layer: 18.42,69.72 20.5,69.72 20.73,69.5 20.73,67.17 20.49,66.93 18.54,66.93 18.42,67.06 18.42,69.71
$1N21920 on Top Layer: 19.69,71.81 21.96,71.81 21.96,70.74 19.69,70.74

Small or netless copper shapes (teardrops, artwork), in the pictures only: 278 on Top Layer, 203 on Bottom Layer, 37 on Inner1, 18 on Inner2
